# Altium project DAU-3Phase-Mainboard.PrjPcb
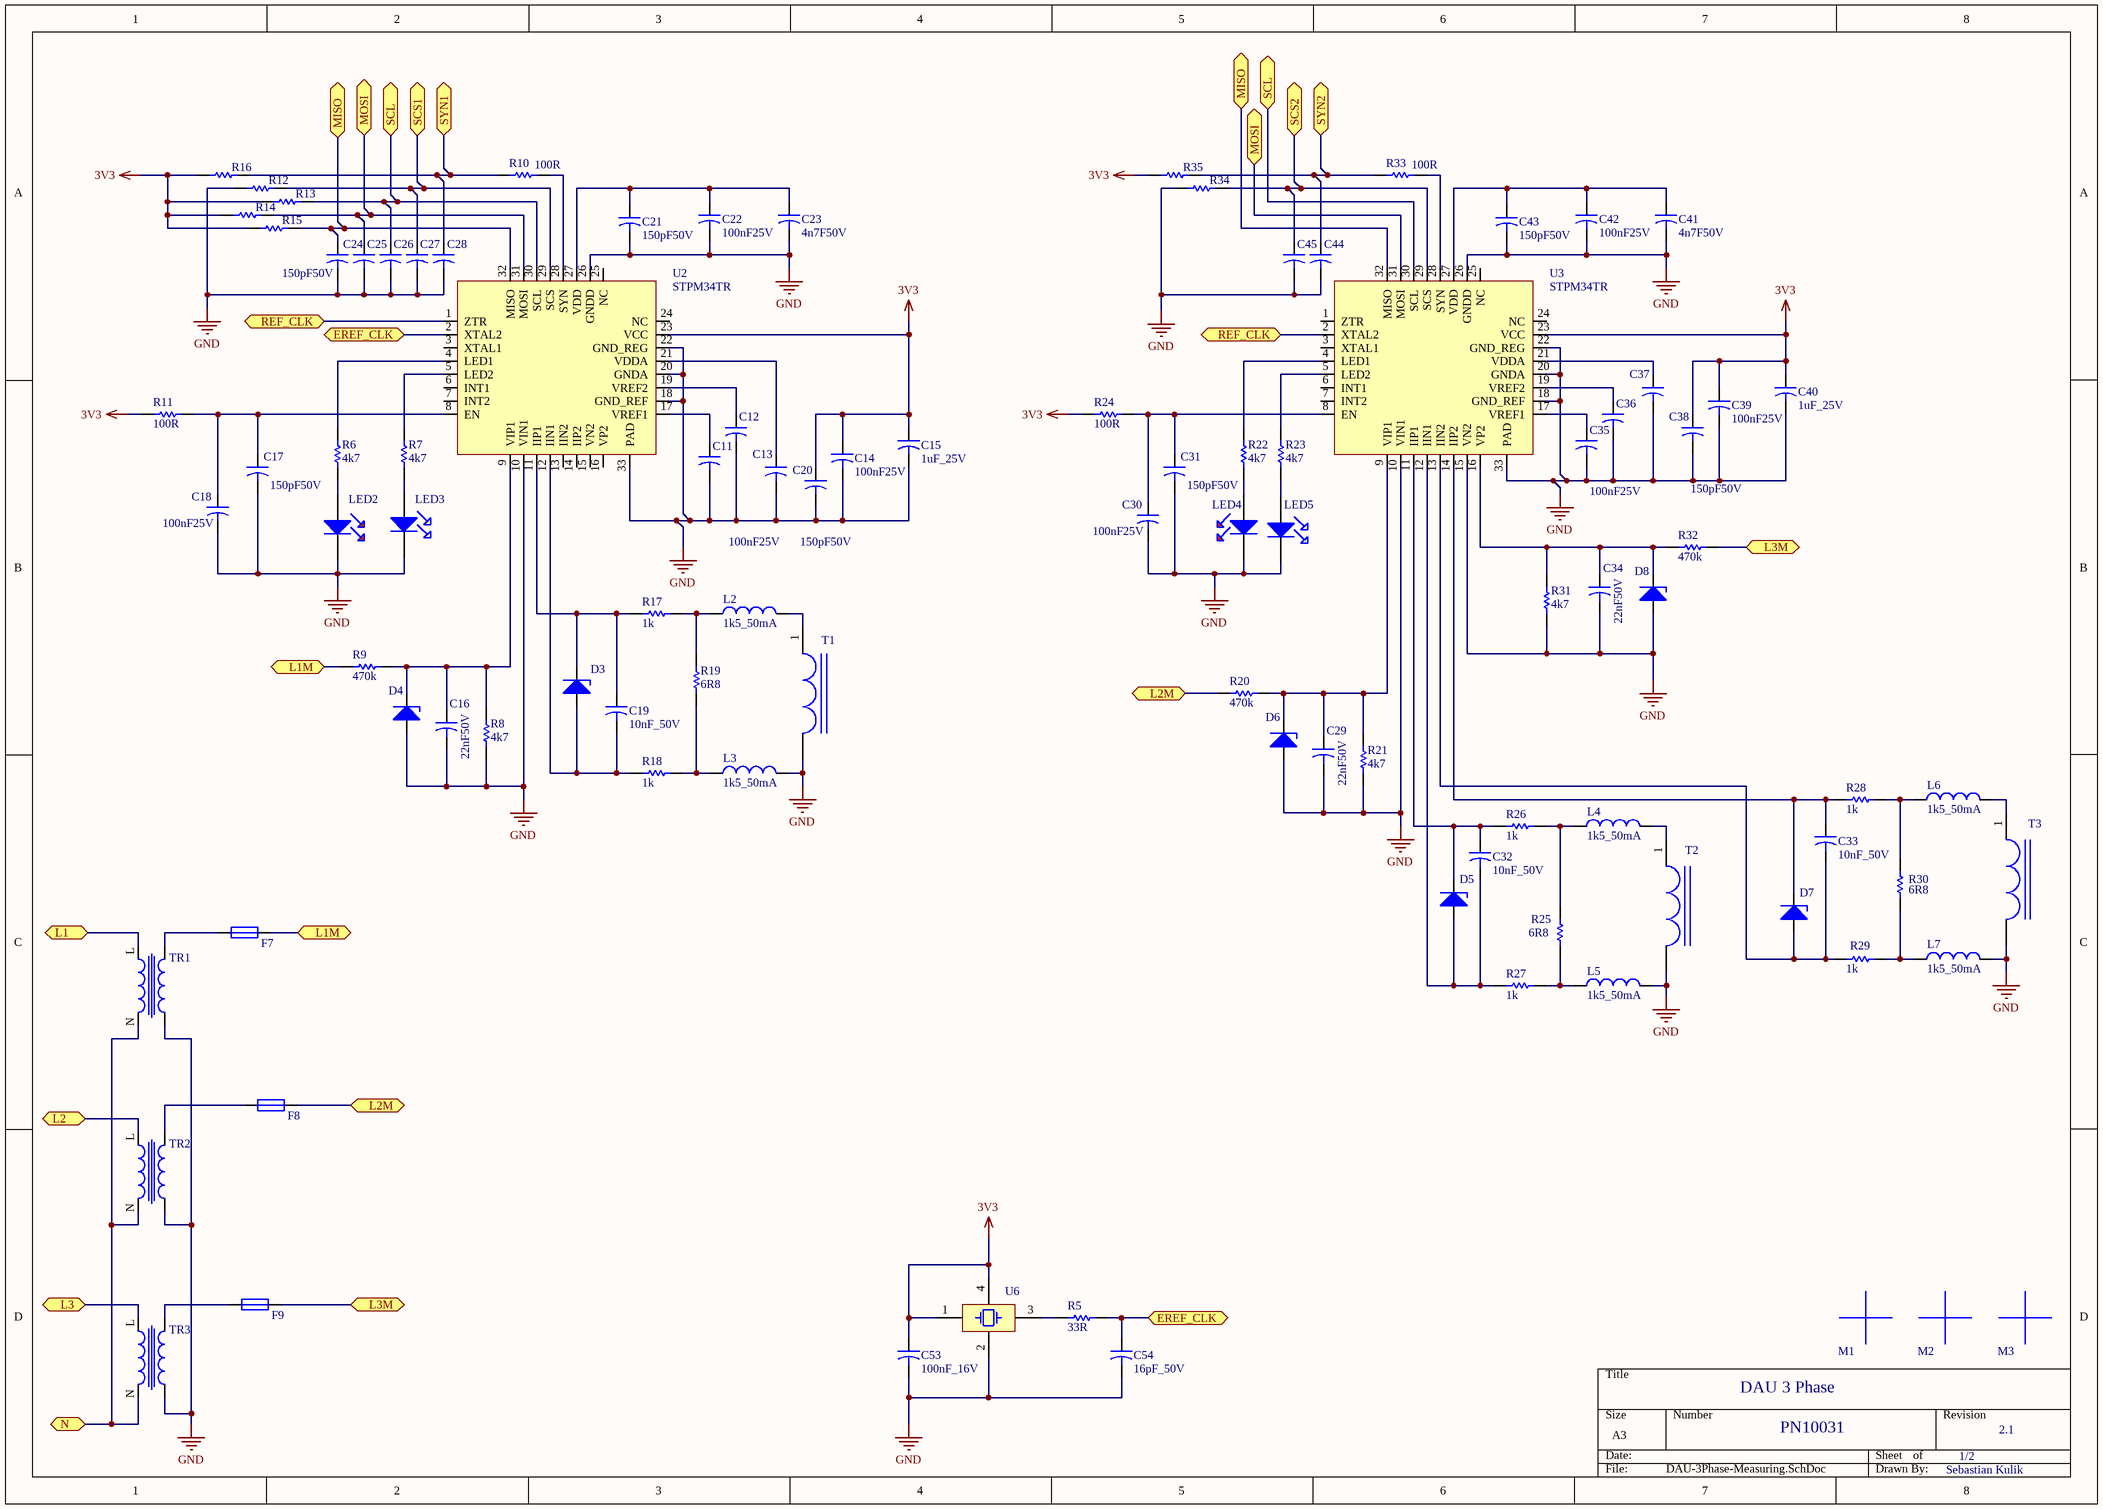
[diagram p0: DAU-3Phase-Measuring.SchDoc]
2 sheets, 149 parts. Net scope: flat (ports and power ports of the same name join across sheets).
Board file: DAU-3Phase-Mainboard.PcbDoc
Sheets:
  DAU-3Phase-Measuring.SchDoc
  DAU-3Phase-PSU.SchDoc

## Sheet DAU-3Phase-Measuring.SchDoc
size A3

### Parts
C11  value 100nF25V  [C0402]  (hidden comment: 100nF25V_0402)
C12  100nF25V_0402  [C0402]  (value not drawn)
C13  100nF25V_0402  [C0402]  (value not drawn)
C14  value 100nF25V  [C0402]  (hidden comment: 100nF25V_0402)
C15  value 1uF_25V  [C0603]  (hidden comment: 1uF25V_0603)
C16  value 22nF50V  [C0603]  (hidden comment: 22nF50V_0603)
C17  value 150pF50V  [C0402]  (hidden comment: 150p50V_0402)
C18  value 100nF25V  [C0402]  (hidden comment: 100nF25V_0402)
C19  value 10nF_50V  [C0603]  (hidden comment: 10nF50V_0603)
C20  value 150pF50V  [C0402]  (hidden comment: 150p50V_0402)
C21  value 150pF50V  [C0402]  (hidden comment: 150p50V_0402)
C22  value 100nF25V  [C0402]  (hidden comment: 100nF25V_0402)
C23  value 4n7F50V  [C0402]  (hidden comment: 4n7F50V_0402)
C24  value 150pF50V  [C0402]  (hidden comment: 150p50V_0402)
C25  150p50V_0402  [C0402]  (value not drawn)
C26  150p50V_0402  [C0402]  (value not drawn)
C27  150p50V_0402  [C0402]  (value not drawn)
C28  150p50V_0402  [C0402]  (value not drawn)
C29  value 22nF50V  [C0603]  (hidden comment: 22nF50V_0603)
C30  value 100nF25V  [C0402]  (hidden comment: 100nF25V_0402)
C31  value 150pF50V  [C0402]  (hidden comment: 150p50V_0402)
C32  value 10nF_50V  [C0603]  (hidden comment: 10nF50V_0603)
C33  value 10nF_50V  [C0603]  (hidden comment: 10nF50V_0603)
C34  value 22nF50V  [C0603]  (hidden comment: 22nF50V_0603)
C35  value 100nF25V  [C0402]  (hidden comment: 100nF25V_0402)
C36  100nF25V_0402  [C0402]  (value not drawn)
C37  100nF25V_0402  [C0402]  (value not drawn)
C38  value 150pF50V  [C0402]  (hidden comment: 150p50V_0402)
C39  value 100nF25V  [C0402]  (hidden comment: 100nF25V_0402)
C40  value 1uF_25V  [C0603]  (hidden comment: 1uF25V_0603)
C41  value 4n7F50V  [C0402]  (hidden comment: 4n7F50V_0402)
C42  value 100nF25V  [C0402]  (hidden comment: 100nF25V_0402)
C43  value 150pF50V  [C0402]  (hidden comment: 150p50V_0402)
C44  150p50V_0402  [C0402]  (value not drawn)
C45  150p50V_0402  [C0402]  (value not drawn)
C53  value 100nF_16V  [C0402]  (hidden comment: 100nF16V_0402)
C54  value 16pF_50V  [C0402]  (hidden comment: 16pF50V_0402)
D3  MMSZ4678T1G  [SOD123]  (value not drawn)
D4  MMSZ4678T1G  [SOD123]  (value not drawn)
D5  MMSZ4678T1G  [SOD123]  (value not drawn)
D6  MMSZ4678T1G  [SOD123]  (value not drawn)
D7  MMSZ4678T1G  [SOD123]  (value not drawn)
D8  MMSZ4678T1G  [SOD123]  (value not drawn)
F7  MCMET 250MA 250V  [TR5]  (value not drawn)
F8  MCMET 250MA 250V  [TR5]  (value not drawn)
F9  MCMET 250MA 250V  [TR5]  (value not drawn)
L2  value 1k5_50mA  [L0603]  (hidden comment: 1k5_50mA_0603)
L3  value 1k5_50mA  [L0603]  (hidden comment: 1k5_50mA_0603)
L4  value 1k5_50mA  [L0603]  (hidden comment: 1k5_50mA_0603)
L5  value 1k5_50mA  [L0603]  (hidden comment: 1k5_50mA_0603)
L6  value 1k5_50mA  [L0603]  (hidden comment: 1k5_50mA_0603)
L7  value 1k5_50mA  [L0603]  (hidden comment: 1k5_50mA_0603)
LED2  WL-SMCW-RED  [WE-0603]  (value not drawn)
LED3  WL-SMCW-YELLOW  [WE-0603]  (value not drawn)
LED4  WL-SMCW-RED  [WE-0603]  (value not drawn)
LED5  WL-SMCW-YELLOW  [WE-0603]  (value not drawn)
M1  Paste Mark  [Mark-3mm]  (value not drawn)
M2  Paste Mark  [Mark-3mm]  (value not drawn)
M3  Paste Mark  [Mark-3mm]  (value not drawn)
R5  value 33R  [R0402]  (hidden comment: 33R_0402)
R6  value 4k7  [R0402]  (hidden comment: 4k7_0402)
R7  value 4k7  [R0402]  (hidden comment: 4k7_0402)
R8  value 4k7  [R0204-MELF4]  (hidden comment: 4k7_0204_MELF)
R9  value 470k  [R0204-MELF4]  (hidden comment: 470k_0204_MELF)
R10  value 100R  [R0402]  (hidden comment: 100R_0402)
R11  value 100R  [R0402]  (hidden comment: 100R_0402)
R12  10k_0402  [R0402]  (value not drawn)
R13  10k_0402  [R0402]  (value not drawn)
R14  10k_0402  [R0402]  (value not drawn)
R15  10k_0402  [R0402]  (value not drawn)
R16  10k_0402  [R0402]  (value not drawn)
R17  value 1k  [R0603(1608)]  (hidden comment: 1k_0603)
R18  value 1k  [R0603(1608)]  (hidden comment: 1k_0603)
R19  value 6R8  [R0204-MELF4]  (hidden comment: 6R8_0204_MELF)
R20  value 470k  [R0204-MELF4]  (hidden comment: 470k_0204_MELF)
R21  value 4k7  [R0204-MELF4]  (hidden comment: 4k7_0204_MELF)
R22  value 4k7  [R0402]  (hidden comment: 4k7_0402)
R23  value 4k7  [R0402]  (hidden comment: 4k7_0402)
R24  value 100R  [R0402]  (hidden comment: 100R_0402)
R25  value 6R8  [R0204-MELF4]  (hidden comment: 6R8_0204_MELF)
R26  value 1k  [R0603(1608)]  (hidden comment: 1k_0603)
R27  value 1k  [R0603(1608)]  (hidden comment: 1k_0603)
R28  value 1k  [R0603(1608)]  (hidden comment: 1k_0603)
R29  value 1k  [R0603(1608)]  (hidden comment: 1k_0603)
R30  value 6R8  [R0204-MELF4]  (hidden comment: 6R8_0204_MELF)
R31  value 4k7  [R0204-MELF4]  (hidden comment: 4k7_0204_MELF)
R32  value 470k  [R0204-MELF4]  (hidden comment: 470k_0204_MELF)
R33  value 100R  [R0402]  (hidden comment: 100R_0402)
R34  10k_0402  [R0402]  (value not drawn)
R35  10k_0402  [R0402]  (value not drawn)
T1  AC1020  [AC1010]  (value not drawn)
T2  AC1020  [AC1010]  (value not drawn)
T3  AC1020  [AC1010]  (value not drawn)
TR1  BV 202 0157  [TRAFO_0,35VA]  (value not drawn)
TR2  BV 202 0157  [TRAFO_0,35VA]  (value not drawn)
TR3  BV 202 0157  [TRAFO_0,35VA]  (value not drawn)
U2  STPM34TR  [QFN32_L-Vias]
U3  STPM34TR  [QFN32_L-Vias]
U6  SG - 211 S*E -16.000M  [SG - 211 S*E]  (value not drawn)

### Ports
EREF_CLK, L1, L1M, L2, L2M, L3, L3M, MISO, MOSI, N, REF_CLK, SCL, SCS1, SCS2, SYN1, SYN2

### Nets
3V3: C14.1 C15.1 C20.1 C38.1 C39.1 C40.1 C53.1 R11.1 R13.1 R14.1 R15.1 R16.1 R24.1 R35.1 U2.23(VCC) U3.23(VCC) U6.1(E/D) U6.4(VCC)
GND: C11.2 C12.2 C13.2 C14.2 C15.2 C16.2 C17.2 C18.2 C20.2 C21.2 C22.2 C23.2 C24.2 C25.2 C26.2 C27.2 C28.2 C29.2 C30.2 C31.2 C34.2 C35.2 C36.2 C37.2 C38.2 C39.2 C40.2 C41.2 C42.2 C43.2 C44.2 C45.2 C53.2 C54.2 D4.2(A) D6.2(A) D8.2(A) L3.2 L5.2 L7.2 LED2.1(K) LED3.1(K) LED4.1(K) LED5.1(K) R8.1 R12.1 R21.1 R31.1 R34.1 T1.2 T2.2 T3.2 TR1.OUT2 TR2.OUT2 TR3.OUT2 U2.10(VIN1) U2.18(GND_REF) U2.20(GNDA) U2.22(GND_REG) U2.26(GNDD) U2.33(PAD) U3.10(VIN1) U3.15(VN2) U3.18(GND_REF) U3.20(GNDA) U3.22(GND_REG) U3.26(GNDD) U3.33(PAD) U6.2(GND)
NetC1_1: TR1.L ; port L1
NetC11_1: C11.1 U2.17(VREF1)
NetC12_1: C12.1 U2.19(VREF2)
NetC13_1: C13.1 U2.21(VDDA)
NetC16_1: C16.1 D4.1(K) R8.2 R9.2 U2.9(VIP1)
NetC17_1: C17.1 C18.1 R11.2 U2.8(EN)
NetC19_1: C19.1 D3.1(K) R17.1 U2.11(IIP1)
NetC19_2: C19.2 D3.2(A) R18.1 U2.12(IIN1)
NetC21_1: C21.1 C22.1 C23.1 U2.27(VDD)
NetC24_1: C24.1 R15.2 U2.32(MISO) U3.32(MISO) ; port MISO
NetC25_1: C25.1 R14.2 U2.31(MOSI) U3.31(MOSI) ; port MOSI
NetC26_1: C26.1 R13.2 U2.30(SCL) U3.30(SCL) ; port SCL
NetC27_1: C27.1 R12.2 U2.29(SCS) ; port SCS1
NetC28_1: C28.1 R10.2 R16.2 ; port SYN1
NetC29_1: C29.1 D6.1(K) R20.2 R21.2 U3.9(VIP1)
NetC30_1: C30.1 C31.1 R24.2 U3.8(EN)
NetC32_1: C32.1 D5.1(K) R26.1 U3.11(IIP1)
NetC32_2: C32.2 D5.2(A) R27.1 U3.12(IIN1)
NetC33_1: C33.1 D7.1(K) R28.1 U3.14(IIP2)
NetC33_2: C33.2 D7.2(A) R29.1 U3.13(IIN2)
NetC34_1: C34.1 D8.1(K) R31.2 R32.2 U3.16(VP2)
NetC35_1: C35.1 U3.17(VREF1)
NetC36_1: C36.1 U3.19(VREF2)
NetC37_1: C37.1 U3.21(VDDA)
NetC41_1: C41.1 C42.1 C43.1 U3.27(VDD)
NetC44_1: C44.1 R33.2 R35.2 ; port SYN2
NetC45_1: C45.1 R34.2 U3.29(SCS) ; port SCS2
NetC50_2: TR1.N TR2.N TR3.N ; port N
NetC54_1: C54.1 R5.2 U2.2(XTAL2) ; port EREF_CLK
NetF2_2: TR2.L ; port L2
NetF3_2: TR3.L ; port L3
NetF7_1: F7.1 TR1.OUT1
NetF7_2: F7.2 R9.1 ; port L1M
NetF8_1: F8.1 TR2.OUT1
NetF8_2: F8.2 R20.1 ; port L2M
NetF9_1: F9.1 TR3.OUT1
NetF9_2: F9.2 R32.1 ; port L3M
NetL2_1: L2.1 R17.2 R19.2
NetL2_2: L2.2 T1.1
NetL3_1: L3.1 R18.2 R19.1
NetL4_1: L4.1 R25.2 R26.2
NetL4_2: L4.2 T2.1
NetL5_1: L5.1 R25.1 R27.2
NetL6_1: L6.1 R28.2 R30.2
NetL6_2: L6.2 T3.1
NetL7_1: L7.1 R29.2 R30.1
NetLED2_2: LED2.2(A) R6.1
NetLED3_2: LED3.2(A) R7.1
NetLED4_2: LED4.2(A) R22.1
NetLED5_2: LED5.2(A) R23.1
NetR5_1: R5.1 U6.3(OSC2)
NetR6_2: R6.2 U2.4(LED1)
NetR7_2: R7.2 U2.5(LED2)
NetR10_1: R10.1 U2.28(SYN)
NetR22_2: R22.2 U3.4(LED1)
NetR23_2: R23.2 U3.5(LED2)
NetR33_1: R33.1 U3.28(SYN)
NetU2_1: U2.1(ZTR) U3.2(XTAL2) ; port REF_CLK

Not connected (* = marked no-connect by the designer): U2 3(XTAL1) 6(INT1) 7(INT2) 13(IIN2) 14(IIP2) 15(VN2) 16(VP2) 24(NC) 25(NC); U3 1(ZTR) 3(XTAL1) 6(INT1) 7(INT2) 24(NC) 25(NC)

### Notes on the sheet
- DAU 3 Phase
- PN10031
- 1/2
- 2.1
- Sebastian Kulik

### Library data of the parts
C11-C14 C18 C22 C30 C35-C37 C39 C42 = 100nF25V_0402: AVX, X5R, 10%, 25V; Deliverer PartNr: 1833862; Manufacturer PartNr: 04023D104KAT2A; Deliverer: Farnell; TDE-PN: C0036; Published: 09.12.2014; Part Description: AVX, X5R, 10%, 25V; Publisher: Sebastian Kulik; PackageDescription: C0402; Manufacturer: AVX
  C12 C13 C36 C37: Value: 100nF25V
C15 C40 = 1uF25V_0603: MLCC series, X5R, 10%, 25V; Deliverer PartNr: 1658868RL; Manufacturer: AVX; Manufacturer PartNr: 06033D105KAT2A; Deliverer: Farnell; TDE-PN: C0006; Published: 13.02.2014; Part Description: MLCC series, X5R, 10%, 25V; Publisher: Sebastian Kulik; PackageDescription: C0603
C16 C29 C34 = 22nF50V_0603: AVX ,  X7R, 5%, 50V; Deliverer PartNr: 1835412; Manufacturer PartNr: 06035C223JAT2A; Deliverer: Farnell; TDE-PN: C0034; Published: 13.02.2014; Part Description: AVX ,  X7R, 5%, 50V; Publisher: Sebastian Kulik; PackageDescription: C0603; Manufacturer: AVX
C17 C20 C21 C24 C31 C38 C43 = 150p50V_0402: C series, 5%, 50V; Part Description: GRM series,5%, 50V; Deliverer PartNr: 8819602; Manufacturer: Murata; Manufacturer PartNr: GRM1555C1H151JA01D; Deliverer: Farnell; TDE-PN: C0059; Published: 11.12.2014; Publisher: Sebastian Kulik; PackageDescription: C0402
C19 C32 C33 = 10nF50V_0603: GRM series,  X7R, 10%, 50V; Deliverer PartNr: 2366904; Manufacturer: Murata; Manufacturer PartNr: GRM188R71H103KA01D; Deliverer: Farnell; TDE-PN: C0060; Published: 12.12.2014; Part Description: GRM series,  X7R, 10%, 50V; Publisher: Sebastian Kulik; PackageDescription: C0603
C23 C41 = 4n7F50V_0402: AVX, X7R, 10%, 50V; Deliverer PartNr: 2280797; Manufacturer PartNr: 04025C472KAT2A; Deliverer: Farnell; TDE-PN: C0001; Published: 11.02.2014; Part Description: AVX, X7R, 10%, 50V; Publisher: Sebastian Kulik; PackageDescription: C0402; Manufacturer: AVX
C25-C28 C44 C45 = 150p50V_0402: C series, 5%, 50V; Part Description: GRM series,5%, 50V; Deliverer PartNr: 8819602; Manufacturer: Murata; Manufacturer PartNr: GRM1555C1H151JA01D; Deliverer: Farnell; TDE-PN: C0059; Value: 150pF50V; Published: 11.12.2014; Publisher: Sebastian Kulik; PackageDescription: C0402
C53 = 100nF16V_0402: TDK. CGA series, X7R, 10%, 16V; Deliverer PartNr: 2366533; Manufacturer: TDK; Manufacturer PartNr: CGA2B1X7R1C104K050BC; Deliverer: Farnell; TDE-PN: C0025; Published: 12.02.2014; Part Description: TDK. CGA series, X7R, 10%, 16V; Publisher: Sebastian Kulik; PackageDescription: C0402
C54 = 16pF50V_0402: C series, 5%, 50V; Deliverer PartNr: 1865423; Manufacturer: Kemet; Manufacturer PartNr: C0402C160J5GACTU; Deliverer: Farnell; TDE-PN: C0020; Published: 11.03.2014; Part Description: C series, 5%, 50V; Publisher: Sebastian Kulik; PackageDescription: C0402
D3-D8 = MMSZ4678T1G: Z-Diode, 1.8V,  0.5W; Deliverer PartNr: 1459115; Manufacturer: ON Semi; TDE-PN: DIS0034; Deliverer: Farnell; Published: 29.04.2014; Publisher: Sebastian Kulik; PackageDescription: SOD-123; Manufacturer PartNr: MMSZ4678T1G
F7-F9 = MCMET 250MA 250V: Deliverer PartNr: 1566065; Manufacturer: Multicomp; Deliverer: Farnell; TDFE-PN: M0008; Published: 05.11.2014; Publisher: Sebastian Kulik; PackageDescription: TR-5; Manufacturer PartNr: MCMET 250MA 250V; Value: MCMET 250MA 250V
L2-L7 = 1k5_50mA_0603: WE, Ferrit, 1k5_50mA_0603; Deliverer PartNr: 742792691; TDE-PN: P0028; Deliverer: WE; Manufacturer: WE; Manufacturer PartNr: 742792691; Published: 11.12.2014; Publisher: Sebastian Kulik; PackageDescription: L0603
LED2 LED4 = WL-SMCW-RED: LED, 0603, red; Manufacturer PartNr: 150060RS75000; TDE-PN: DIS0023; Deliverer: WE; Published: 24.05.2014; Publisher: Sebastian Kulik; PackageDescription: WE-0603; Deliverer PartNr: 150060RS75000; Manufacturer: WE
LED3 LED5 = WL-SMCW-YELLOW: LED, 0603, yellow; Manufacturer PartNr: 150060YS75000; TDE-PN: DIS0025; Deliverer: WE; Published: 24.05.2014; Publisher: Sebastian Kulik; PackageDescription: WE-0603; Deliverer PartNr: 150060YS75000; Manufacturer: WE
M1-M3 = Mark: Comment_1: PasteMark
R5 = 33R_0402: Vishay CRCW series, 63mW, 1%; Manufacturer PartNr: CRCW040233R0FKEAHP; Deliverer PartNr: 1738830; TDE-PN: R0037; Deliverer: Farnell; Published: 12.02.2014; Publisher: Sebastian Kulik; PackageDescription: 0402; Manufacturer: Vishay; Part Description: Vishay CRCW series, 63mW, 1%
R6 R7 R22 R23 = 4k7_0402: Vishay CRCW series, 63mW, 1%; Manufacturer PartNr: CRCW04024K70FKED; Deliverer PartNr: 2121688; TDE-PN: R0009; Deliverer: Farnell; Published: 25.02.2014; Publisher: Sebastian Kulik; PackageDescription: 0402; Manufacturer: Vishay; Part Description: Vishay CRCW series, 63mW, 1%
R8 R21 R31 = 4k7_0204_MELF: MMA series, 1%, 250mW; Manufacturer: Vishay; Manufacturer PartNr: MMA02040E4701BB100; Deliverer PartNr: 3086100; TDE-PN: R0073; Deliverer: Farnell; Published: 23.02.2015; Publisher: Sebastian Kulik; PackageDescription: R0204-MELF4; Part Description: MMA series, 1%, 250mW
R9 R20 R32 = 470k_0204_MELF: MMA series, 1%, 250mW; Manufacturer: Vishay; Manufacturer PartNr: MMA02040C4703FB300; Deliverer PartNr: 3088108; TDE-PN: R0074; Deliverer: Farnell; Published: 23.02.2015; Publisher: Sebastian Kulik; PackageDescription: R0204-MELF4; Part Description: MMA series, 1%, 250mW
R10 R11 R24 R33 = 100R_0402: CRCW series, 125mW, 1%; Manufacturer: Vishay; Manufacturer PartNr: CRCW0402100RFKEAHP; Deliverer PartNr: 1738837RL; TDE-PN: R0026; Deliverer: Farnell; Published: 07.04.2014; Publisher: Sebastian Kulik; PackageDescription: 0402; Part Description: CRCW series, 125mW, 1%
R12-R16 R34 R35 = 10k_0402: Vishay CRCW series, 125mW, 1%; Manufacturer PartNr: CRCW040210K0FKEAHP; Deliverer PartNr: 1738864; TDE-PN: R0012; Deliverer: Farnell; Value: 10k; Published: 12.02.2014; Publisher: Sebastian Kulik; PackageDescription: 0402; Manufacturer: Vishay; Part Description: Vishay CRCW series, 125mW, 1%
R17 R18 R26-R29 = 1k_0603: Vishay CRCW series, 100mW, 1%; Manufacturer PartNr: CRCW06031K00FKTA; Deliverer PartNr: 1652848; TDE-PN: R0070; Deliverer: Farnell; Published: 03.04.2014; Publisher: Sebastian Kulik; PackageDescription: 0603; Manufacturer: Vishay; Part Description: Vishay CRCW series, 100mW, 1%
R19 R25 R30 = 6R8_0204_MELF: MMA series, 1%, 250mW; Manufacturer: Vishay; Manufacturer PartNr: MMA02040C6808FB300; Deliverer PartNr: 3087529; TDE-PN: R0071; Deliverer: Farnell; Published: 12.12.2014; Publisher: Sebastian Kulik; PackageDescription: R0204-MELF4; Part Description: MMA series, 1%, 250mW
T1-T3 = AC1020: Current transformer; Manufacturer PartNr: AC-1020; Deliverer PartNr: 1707839; Manufacturer: Acme Electric; TDE-PN: DIS0028; Deliverer: Farnell; Published: 28.10.2014; Publisher: Sebastian Kulik; PackageDescription: AC1010
TR1-TR3 = BV 202 0157: WE-PD2, 10uH2A; Deliverer PartNr: 1636035; Manufacturer: Hahn; Deliverer: Farnell; TDE-PN: P0024; Manufacturer PartNr: BV 202 0157; Published: 05.11.2014; Publisher: Sebastian Kulik; PackageDescription: TRAFO_0,35VA; Value: BV 202 0157
U2 U3 = STPM34TR: 2 phase voltage/current measuring device; Manufacturer: STMicro; Deliverer: EBV; TDE-PN: IC0064; Published: 10.12.2014; Deliverer PartNr: STPM34TR; PackageDescription: QFN32L; Publisher: Sebastian Kulik; Manufacturer PartNr: STPM34TR
U6 = SG - 211 S*E -16.000M: Crystal; Deliverer PartNr: 2405755; Manufacturer PartNr: X1G0036210032; Manufacturer: Epson; Deliverer: Farnell; TDE-PN: IC0061; Published: 11.12.2014; PackageDescription: SG-221 S*E; Publisher: Sebastian Kulik

## Sheet DAU-3Phase-PSU.SchDoc
size A3
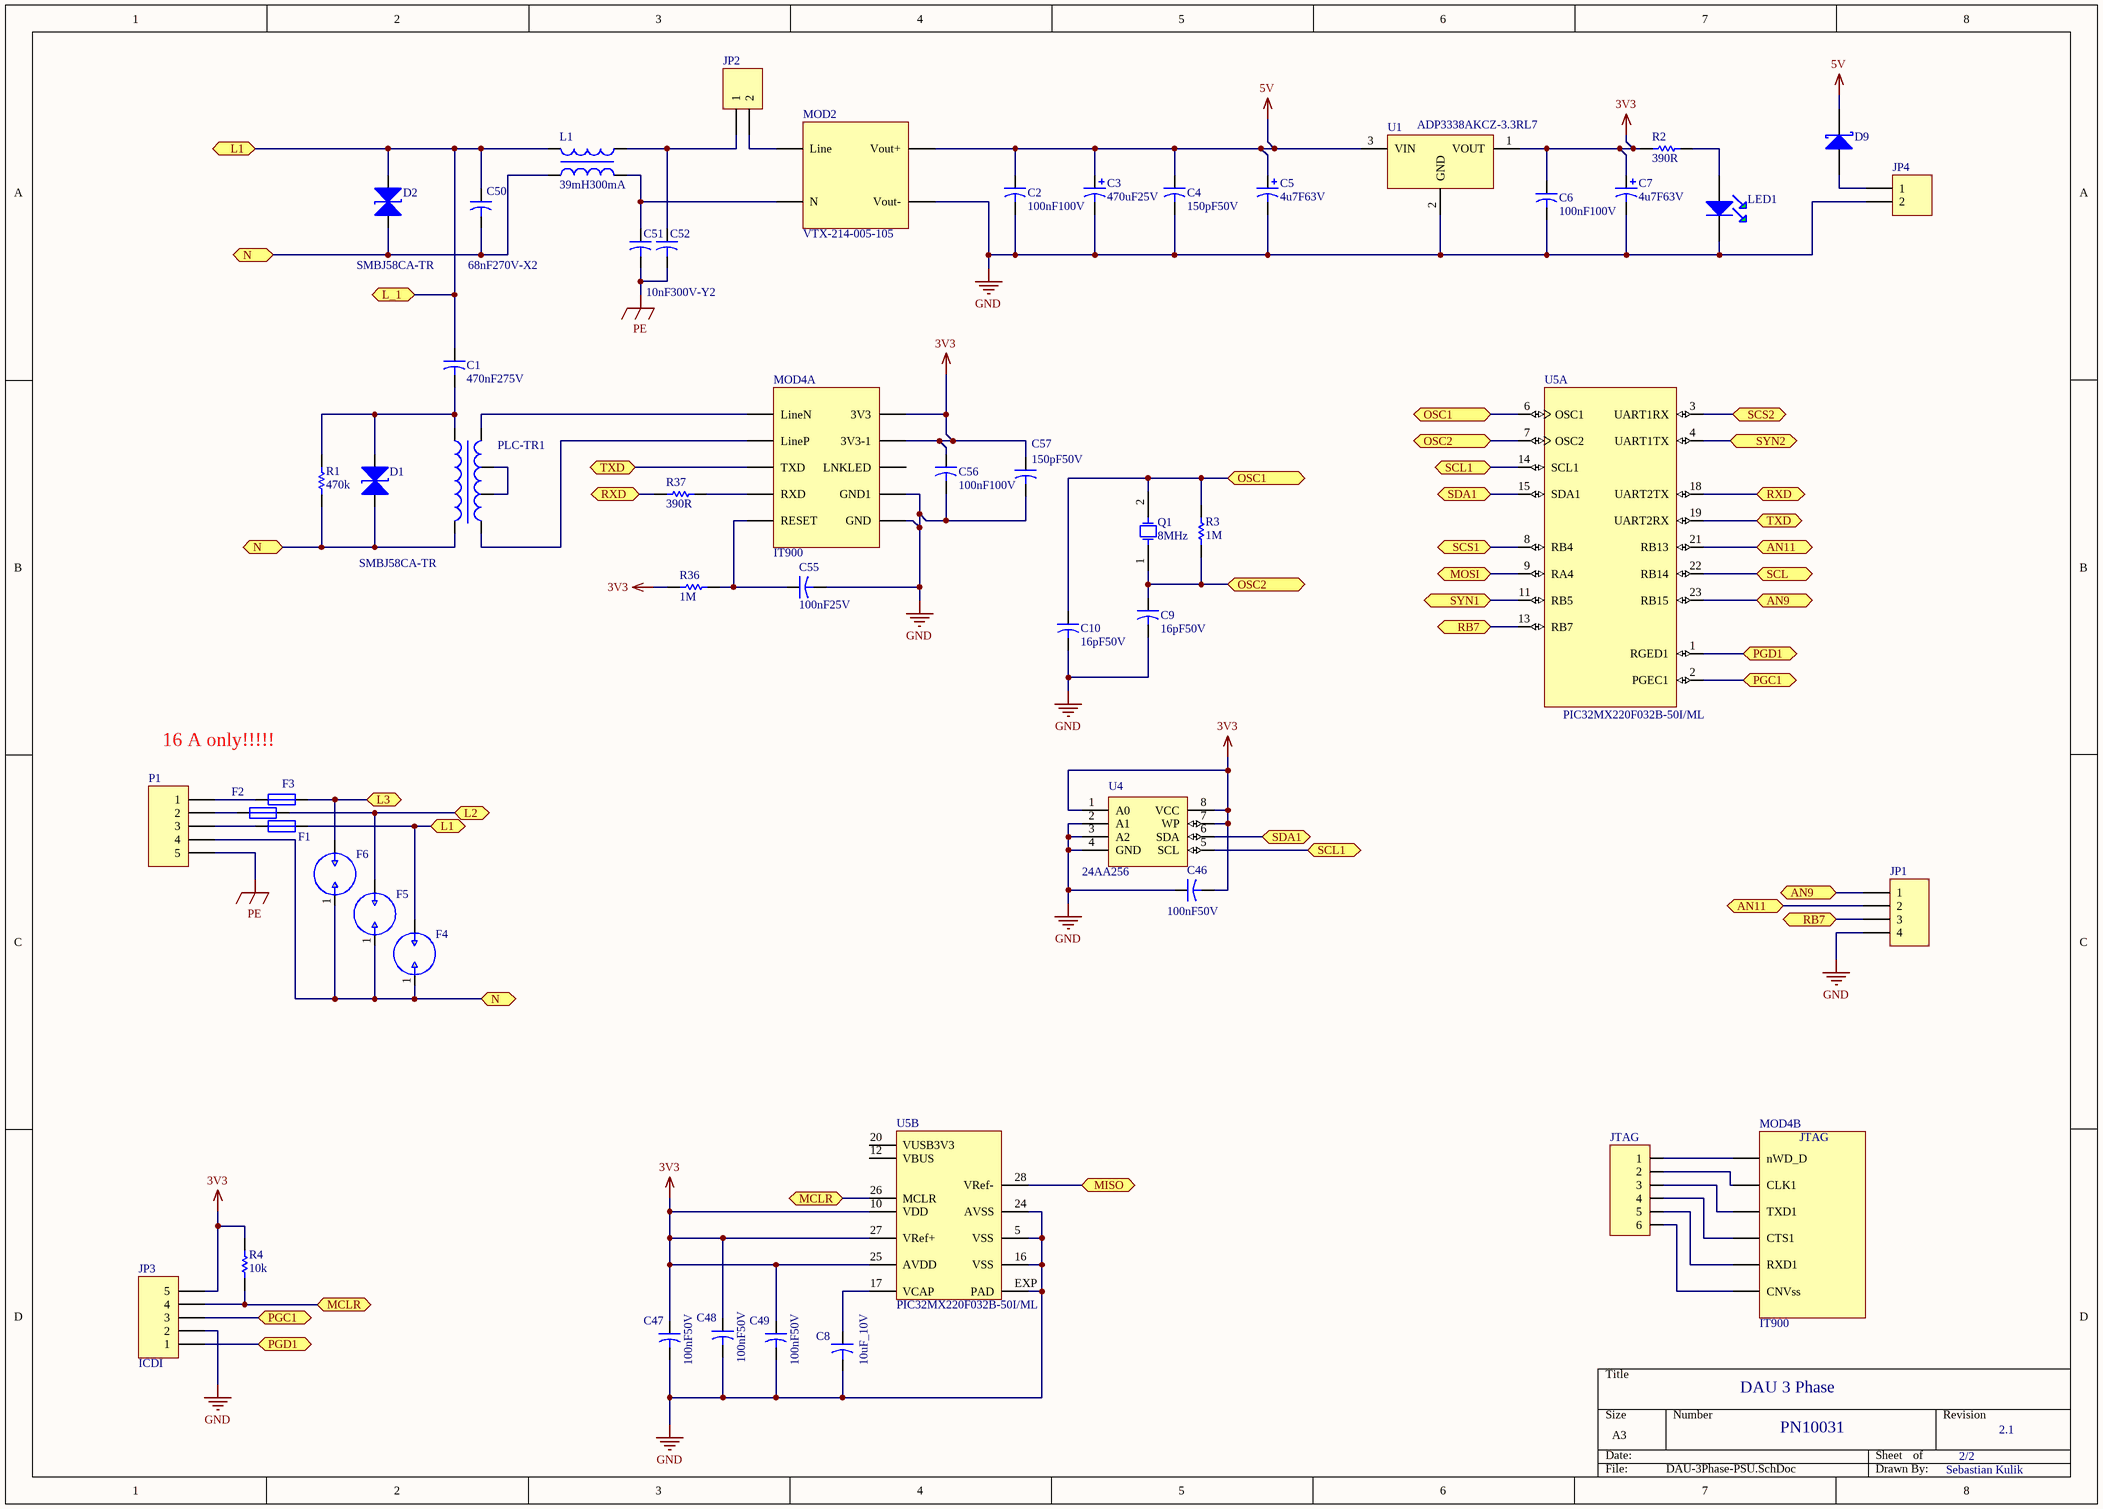
[diagram p1: DAU-3Phase-PSU.SchDoc]

### Parts
C1  470nF275V  [C150-072X183]
C2  value 100nF100V  [C0805]  (hidden comment: 100nF100V_0805)
C3  value 470uF25V  [Panasonic-FT-F_Case]  (hidden comment: 470uF25V_POL_FT)
C4  value 150pF50V  [C0402]  (hidden comment: 150p50V_0402)
C5  value 4u7F63V  [Panasonic-FT-C_Case]  (hidden comment: 4u7F25V_POL_TK)
C6  value 100nF100V  [C0805]  (hidden comment: 100nF100V_0805)
C7  value 4u7F63V  [Panasonic-FT-C_Case]  (hidden comment: 4u7F25V_POL_TK)
C8  value 10uF_10V  [C0603]  (hidden comment: 10uF10V_0603)
C9  value 16pF50V  [C0402]  (hidden comment: 16pF50V_0402)
C10  value 16pF50V  [C0402]  (hidden comment: 16pF50V_0402)
C46  value 100nF50V  [C0402]  (hidden comment: 100n50V_0402)
C47  value 100nF50V  [C0402]  (hidden comment: 100n50V_0402)
C48  value 100nF50V  [C0402]  (hidden comment: 100n50V_0402)
C49  value 100nF50V  [C0402]  (hidden comment: 100n50V_0402)
C50  68nF270V-X2  [Foil-7,5x10]
C51  10nF300V-Y2  [Foil-10x13]  (value not drawn)
C52  10nF300V-Y2  [Foil-10x13]
C55  value 100nF25V  [C0402]  (hidden comment: 100nF25V_0402)
C56  value 100nF100V  [C0805]  (hidden comment: 100nF100V_0805)
C57  value 150pF50V  [C0402]  (hidden comment: 150p50V_0402)
D1  SMBJ58CA-TR  [SMB]
D2  SMBJ58CA-TR  [SMB]
D9  RB160M-30TR  [SOD123]  (value not drawn)
F1  MCMET 250MA 250V  [TR5]  (value not drawn)
F2  MCMET 250MA 250V  [TR5]  (value not drawn)
F3  MCMET 250MA 250V  [TR5]  (value not drawn)
F4  GDT-SL1011A-1  [SL1011A/SL1011B]  (value not drawn)
F5  GDT-SL1011A-1  [SL1011A/SL1011B]  (value not drawn)
F6  GDT-SL1011A-1  [SL1011A/SL1011B]  (value not drawn)
JP1  Plug_4_90_2.54  [HDR1X4]  (value not drawn)
JP2  Header-2  [HDR1X2]  (value not drawn)
JP3  ICDI  [HDR1X5-1.27]
JP4  Header-2  [HDR1X2]  (value not drawn)
JTAG  JTAG  [HDR1X6-1.27]  (value not drawn)
L1  value 39mH300mA  [WE-CMB-XS]  (hidden comment: PowerChoke-2)
LED1  WL-SMCW-GREEN  [WE-0603]  (value not drawn)
MOD2  VTX-214-005-105  [VTX-214-005-105]
MOD4  IT900  [IT900-PIM]  (parts A,B of 2)
P1  Plug_05_5mm  [CONNECTOR_5_POL-5mm]  (value not drawn)
PLC-TR1  PLC-Transformer  [PLC-UEBERTRAGER_V2]  (value not drawn)
Q1  value 8MHz  [ABM3]  (hidden comment: Crystal_8MHz_1)
R1  value 470k  [0204/7]  (hidden comment: 470k_0204/7)
R2  value 390R  [R0402]  (hidden comment: 390R_0402)
R3  value 1M  [R0402]  (hidden comment: 1M_0402)
R4  value 10k  [R0402]  (hidden comment: 10k_0402)
R36  value 1M  [R0402]  (hidden comment: 1M_0402)
R37  value 390R  [R0402]  (hidden comment: 390R_0402)
U1  ADP3338AKCZ-3.3RL7  [SOT223-1]
U4  24AA256  [TSSOP8]
U5  PIC32MX220F032B-50I/ML  [QFN28_LONG_ERRLES-Vias]  (parts A,B of 2)

### Ports
AN9, AN11, L1, L2, L3, L_1, MCLR, MISO, MOSI, N, OSC1, OSC2, PGC1, PGD1, RB7, RXD, SCL, SCL1, SCS1, SCS2, SDA1, SYN1, SYN2, TXD

### Nets
3V3: C6.1 C7.1 C46.2 C47.1 C48.1 C49.1 C56.1 C57.1 JP3.5 MOD4.4(3V3) MOD4.5(3V3-1) R2.1 R4.2 R36.1 U1.1(VOUT) U4.1(A0) U4.7(WP) U4.8(VCC) U5.10(VDD) U5.25(AVDD) U5.27(VRef+)
5V: C2.1 C3.1 C4.1 C5.1 D9.1(K) MOD2.+VO(Vout+) U1.3(VIN)
GND: C2.2 C3.2 C4.2 C5.2 C6.2 C7.2 C8.2 C9.2 C10.2 C46.1 C47.2 C48.2 C49.2 C55.2 C56.2 C57.2 JP1.4 JP3.2 JP4.2 LED1.1(K) MOD2.-VO(Vout-) MOD4.2(GND) MOD4.3(GND1) U1.2(GND) U4.2(A1) U4.3(A2) U4.4(GND) U5.5(VSS) U5.16(VSS) U5.24(AVSS) U5.EXP(PAD)
PE: C51.2 C52.2 P1.5
NetC1_1: C1.1 C50.1 D2.2(A) F1.2 F4.2 L1.2 ; port L_1, port L1
NetC1_2: C1.2 D1.2(A) PLC-TR1.L5 R1.2
NetC8_1: C8.1 U5.17(VCAP)
NetC9_1: C9.1 Q1.1 R3.1 U5.7(OSC2) ; port OSC2
NetC10_1: C10.1 Q1.2 R3.2 U5.6(OSC1) ; port OSC1
NetC24_1: U5.28(VRef-) ; port MISO
NetC25_1: U5.9(RA4) ; port MOSI
NetC26_1: U5.22(RB14) ; port SCL
NetC27_1: U5.8(RB4) ; port SCS1
NetC28_1: U5.11(RB5) ; port SYN1
NetC44_1: U5.4(UART1TX) ; port SYN2
NetC45_1: U5.3(UART1RX) ; port SCS2
NetC50_2: C50.2 D1.1(K) D2.1(K) F4.1 F5.1 F6.1 L1.1 P1.4 PLC-TR1.8N R1.1 ; port N
NetC51_1: C51.1 L1.4 MOD2.N
NetC52_1: C52.1 JP2.1 L1.3
NetC55_1: C55.1 MOD4.9(RESET) R36.2
NetD9_2: D9.2(A) JP4.1
NetF1_1: F1.1 P1.3
NetF2_1: F2.1 P1.2
NetF2_2: F2.2 F5.2 ; port L2
NetF3_1: F3.1 P1.1
NetF3_2: F3.2 F6.2 ; port L3
NetJP1_1: JP1.1 U5.23(RB15) ; port AN9
NetJP1_2: JP1.2 U5.21(RB13) ; port AN11
NetJP1_3: JP1.3 U5.13(RB7) ; port RB7
NetJP2_2: JP2.2 MOD2.L(Line)
NetJP3_1: JP3.1 U5.1(RGED1) ; port PGD1
NetJP3_3: JP3.3 U5.2(PGEC1) ; port PGC1
NetJP3_4: JP3.4 R4.1 U5.26(MCLR) ; port MCLR
NetJTAG_1: JTAG.1 MOD4.26(nWD_D)
NetJTAG_2: JTAG.2 MOD4.27(CLK1)
NetJTAG_3: JTAG.3 MOD4.28(TXD1)
NetJTAG_4: JTAG.4 MOD4.29(CTS1)
NetJTAG_5: JTAG.5 MOD4.30(RXD1)
NetJTAG_6: JTAG.6 MOD4.31(CNVss)
NetLED1_2: LED1.2(A) R2.2
NetMOD4_16: MOD4.16(TXD) U5.19(UART2RX) ; port TXD
NetMOD4_17: MOD4.17(RXD) R37.2
NetMOD4_20: MOD4.20(LineN) PLC-TR1.1LINE1(LINE1)
NetMOD4_21: MOD4.21(LineP) PLC-TR1.4LINE2
NetPLC-TR1_2: PLC-TR1.2 PLC-TR1.3
NetR37_1: R37.1 U5.18(UART2TX) ; port RXD
NetU4_5: U4.5(SCL) U5.14(SCL1) ; port SCL1
NetU4_6: U4.6(SDA) U5.15(SDA1) ; port SDA1

Not connected (* = marked no-connect by the designer): MOD4 22(LNKLED); U5 12(VBUS) 20(VUSB3V3)

### Notes on the sheet
- 16 A only!!!!!
- DAU 3 Phase
- PN10031
- 2/2
- 2.1
- Sebastian Kulik
- (in symbol IT900, part B) JTAG

### Library data of the parts
C1 = 470nF275V: X2, PP; Deliverer PartNr: 2450023; Manufacturer: WE; Manufacturer PartNr: 890324025039CS; Deliverer: Farnell; TDE-PN: C0053; Published: 07.11.2014; Part Description: X2, PP; Publisher: Sebastian Kulik; PackageDescription: C150-072X183; Value: 470nF275V
C2 C6 C56 = 100nF100V_0805: AVX, X7R, 5%, 100V; Deliverer PartNr: 2332715; Manufacturer PartNr: 08051C104JAT2A; Deliverer: Farnell; TDE-PN: C0049; Published: 27.10.2014; Part Description: AVX, X7R, 5%, 100V; Publisher: Sebastian Kulik; PackageDescription: C0805; Manufacturer: AVX
C3 = 470uF25V_POL_FT: Panasonic, FT series; Deliverer PartNr: 1868411; Manufacturer PartNr: EEEFT1E471AP; Deliverer: Farnell; TDE-PN: C0048; Published: 23.09.2014; Part Description: Panasonic, FT series; Publisher: Sebastian Kulik; PackageDescription: Panasonic-FT-F; Manufacturer: Panasonic
C4 C57 = 150p50V_0402: as C17 on sheet DAU-3Phase-Measuring; Published: 11.12.2014; Publisher: Sebastian Kulik; PackageDescription: C0402
C5 C7 = 4u7F25V_POL_TK: Panasonic, TK series; Deliverer PartNr: 9695990; Manufacturer PartNr: EEEFK1J4R7R; Deliverer: Farnell; TDE-PN: C0058; Published: 11.12.2014; Part Description: Panasonic, TK series; Publisher: Sebastian Kulik; PackageDescription: Panasonic-FT-C_Case; Manufacturer: Panasonic
C8 = 10uF10V_0603: AVX ,  X5R, 20%, 10V; Deliverer PartNr: 1867954RL; Manufacturer PartNr: 0603ZD106MAT2A; Deliverer: Farnell; TDE-PN: C0016; Published: 11.02.2014; Part Description: AVX ,  X5R, 20%, 10V; Publisher: Sebastian Kulik; PackageDescription: C0603; Manufacturer: AVX
C9 C10 = 16pF50V_0402: as C54 on sheet DAU-3Phase-Measuring; Published: 11.03.2014; Part Description: C series, 5%, 50V; Publisher: Sebastian Kulik; PackageDescription: C0402
C46-C49 = 100n50V_0402: C series, X5R, 10%, 50V; Part Description: GRM series, X5R, 10%, 50V; Deliverer PartNr: 2218856; Manufacturer: Murata; Manufacturer PartNr: GRM155R61H104KE19D; Deliverer: Farnell; TDE-PN: C0044; Published: 13.02.2014; Publisher: Sebastian Kulik; PackageDescription: C0402
C50 = 68nF270V-X2: X2 capacitor; Deliverer PartNr: 890324022017CS; Deliverer: We; TDE-PN: C0061; Published: 21.01.2015; Part Description: X2 capacitor; Publisher: Sebastian Kulik; PackageDescription: Foil-7,5x10; Manufacturer: WE; Manufacturer PartNr: 890324022017CS; Value: 68nF270V-X2
C51 C52 = 10nF300V-Y2: Y2 capacitor; Deliverer PartNr: 2395807; Manufacturer: EPCOS; Manufacturer PartNr: B32021A3103M; Deliverer: Farnell; TDE-PN: C0062; Published: 22.01.2015; Part Description: Y2 capacitor; Publisher: Sebastian Kulik; PackageDescription: Foil-10x13; Value: 10nF300V-Y2
C55 = 100nF25V_0402: as C11 on sheet DAU-3Phase-Measuring; Published: 09.12.2014; Part Description: AVX, X5R, 10%, 25V; Publisher: Sebastian Kulik; PackageDescription: C0402; Manufacturer: AVX
D1 D2 = SMBJ58CA-TR: Transient voltage suppressor, 600W; Deliverer PartNr: 9886346; Manufacturer: STMicro; TDE-PN: DIS0036; Deliverer: Farnell; Published: 22.01.2015; Publisher: Sebastian Kulik; PackageDescription: SMB; Manufacturer PartNr: SMBJ58CA-TR
D9 = RB160M-30TR: Diode Schottky,2A,40V; Deliverer PartNr: 1525480; Manufacturer: Rohm; TDE-PN: DIS0010; Deliverer: Farnell; Published: 17.02.2014; Publisher: Sebastian Kulik; PackageDescription: SOD123; Manufacturer PartNr: RB160M-30TR
F1-F3 = MCMET 250MA 250V: as F7 on sheet DAU-3Phase-Measuring; Published: 05.11.2014; Publisher: Sebastian Kulik; PackageDescription: TR-5; Manufacturer PartNr: MCMET 250MA 250V; Value: MCMET 250MA 250V
F4-F6 = GDT-SL1011A-1: surge protector; Manufacturer PartNr: SL1011B250A; Deliverer PartNr: 1815462; Manufacturer: LITTLEFUSE; TDE-PN: P0031; Deliverer: Farnell; Published: 12.12.2014; Publisher: Sebastian Kulik; PackageDescription: SL1011A/SL1011B
JP1 = Plug_4_90_2.54: Plug, 4-Pin; Manufacturer PartNr: 613 004 111 21; Manufacturer: WE; TDE-PN: CON0033; LatestRevisionDate: 06.11.2014; LatestRevisionNote: Re-released for DXP Platform.; Publisher: Sebastian Kulik; Deliverer: WE; Deliverer PartNr: 613 004 111 21
JP2 JP4 = Header-2: Header, 2-Pin; LatestRevisionDate: 18.02.2014; LatestRevisionNote: Re-released for DXP Platform.; Publisher: Sebastian Kulik
JP3 = ICDI: Header, 5-Pin; LatestRevisionDate: 17-Jul-2002; LatestRevisionNote: Re-released for DXP Platform.; Publisher: Sebastian Kulik; PackageDescription: HDR1X1.27
JTAG = ICDI_1: Header, 6-Pin; LatestRevisionDate: 17-Jul-2002; LatestRevisionNote: Re-released for DXP Platform.; Publisher: Sebastian Kulik; PackageDescription: HDR1X1.27
L1 = PowerChoke-1_2: Power choke/EMC filter; Deliverer PartNr: 744821039; Deliverer: WE; TDE-PN: P0033; Manufacturer: WE; Manufacturer PartNr: 744821039; Published: 21.01.2015; Publisher: Sebastian Kulik; PackageDescription: WE-CMB-XS
LED1 = WL-SMCW-GREEN: LED, 0603, green; Manufacturer PartNr: 150060GS75000; TDE-PN: DIS0024; Deliverer: WE; Published: 24.05.2014; Publisher: Sebastian Kulik; PackageDescription: WE-0603; Deliverer PartNr: 150060GS75000; Manufacturer: WE
MOD2 = VTX-214-005-105: PSU module; Deliverer PartNr: 2401040; Manufacturer: VIGORTRONIX; Deliverer: Farnell; TDE-PN: MOD00005; Published: 15.12.2014; PackageDescription: VTX-214-005-105; Publisher: Sebastian Kulik; Manufacturer PartNr: VTX-214-005-105
MOD4 = IT900: RMS converter; Deliverer PartNr: MOD00001; Deliverer: TDE; TDE-PN: MOD00004; Published: 15.12.2014; PackageDescription: TO100-10; Publisher: Sebastian Kulik; Manufacturer PartNr: MOD00001; Manufacturer: TDE
P1 = Plug_05_5mm: Plug, 08-Pin; Manufacturer PartNr: 1715187; Manufacturer: Phoenix Contact; Deliverer PartNr: 2509901353; Deliverer: RS Components; TDE-PN: CON0037; LatestRevisionDate: 19.11.2014; LatestRevisionNote: Re-released for DXP Platform.; Publisher: Sebastian Kulik
PLC-TR1 = PLC-Transformer: Deliverer PartNr: T60403-K5024-X044; Manufacturer: VAC; Deliverer: SOS Electronic; TDE-PN: P0025; Manufacturer PartNr: T60403-K5024-X044; Published: 13.05.2014; Publisher: Sebastian Kulik; PackageDescription: PLC-UEBERTRAGER_V2
Q1 = Crystal_8MHz_1: Crystal, ABM3-8.000MHZ-D2Y-T; Deliverer PartNr: 2101329; Manufacturer: Abacon; Deliverer: Farnell; TDE-PN: P0032; Published: 20.01.2015; PackageDescription: ABM3; Publisher: Sebastian Kulik; Manufacturer PartNr: ABM3-8.000MHZ-D2Y-T
R1 = 470k_0204/7: MRS25 series, 1%, 600mW; Manufacturer: Vishay; Manufacturer PartNr: MRS25000C4703FCT00; Deliverer PartNr: 9468455; TDE-PN: R0061; Deliverer: Farnell; Published: 07.11.2014; Publisher: Sebastian Kulik; PackageDescription: 0204/7; Part Description: MRS25 series, 1%, 600mW
R2 R37 = 390R_0402: CRCW series, 125mW, 1%; Manufacturer: Vishay; Manufacturer PartNr: CRCW0402390RFKEAHP; Deliverer PartNr: 1469662RL; TDE-PN: R0044; Deliverer: Farnell; Published: 30.04.2014; Publisher: Sebastian Kulik; PackageDescription: 0402; Part Description: CRCW series, 125mW, 1%
R3 R36 = 1M_0402: Vishay CRCW series, 64mW, 1%; Manufacturer PartNr: CRCW04021M00FKED; Deliverer PartNr: 1469667; Part Description: Vishay CRCW series, 63mW, 1%; TDE-PN: R0005; Deliverer: Farnell; Published: 03.04.2014; Publisher: Sebastian Kulik; PackageDescription: 0402; Manufacturer: Vishay
R4 = 10k_0402: Vishay CRCW series, 125mW, 1%; Manufacturer PartNr: CRCW040210K0FKEAHP; Deliverer PartNr: 1738864; TDE-PN: R0012; Deliverer: Farnell; Published: 12.02.2014; Publisher: Sebastian Kulik; PackageDescription: 0402; Manufacturer: Vishay; Part Description: Vishay CRCW series, 125mW, 1%
U1 = ADP3338AKCZ-3.3RL7: LDO, 3V3_1A; Deliverer PartNr: 1651283; Manufacturer: ADI; Deliverer: Farnell; TDE-PN: IC0003; Published: 26.03.2014; PackageDescription: SOT223-1; Publisher: Sebastian Kulik; Manufacturer PartNr: ADP3338AKCZ-3.3RL7
U4 = 24AA256: I2C  EEPROM; Deliverer PartNr: 1331295; Manufacturer: Microchip; Deliverer: Farnell; TDE-PN: IC0005; Published: 28.03.2014; PackageDescription: TSSOP8; Publisher: Sebastian Kulik; Manufacturer PartNr: 24AA256
U5 = PIC32MX220F032B-50I/ML: High Performance ROM-less Microcontroller; Deliverer PartNr: 2357345; Manufacturer: Microchip; Deliverer: Farnell; TDE-PN: IC0063; Published: 19.01.2015; PackageDescription: QFN28; Publisher: Sebastian Kulik; Manufacturer PartNr: PIC32MX220F032B-50I/ML

## Nets that join several sheets
3V3: DAU-3Phase-Measuring (18 pins), DAU-3Phase-PSU (21 pins)
GND: DAU-3Phase-Measuring (69 pins), DAU-3Phase-PSU (31 pins)
NetC1_1: DAU-3Phase-Measuring (TR1.L), DAU-3Phase-PSU (6 pins)
NetC24_1: DAU-3Phase-Measuring (C24.1 R15.2 U2.32 U3.32), DAU-3Phase-PSU (U5.28)
NetC25_1: DAU-3Phase-Measuring (C25.1 R14.2 U2.31 U3.31), DAU-3Phase-PSU (U5.9)
NetC26_1: DAU-3Phase-Measuring (C26.1 R13.2 U2.30 U3.30), DAU-3Phase-PSU (U5.22)
NetC27_1: DAU-3Phase-Measuring (C27.1 R12.2 U2.29), DAU-3Phase-PSU (U5.8)
NetC28_1: DAU-3Phase-Measuring (C28.1 R10.2 R16.2), DAU-3Phase-PSU (U5.11)
NetC44_1: DAU-3Phase-Measuring (C44.1 R33.2 R35.2), DAU-3Phase-PSU (U5.4)
NetC45_1: DAU-3Phase-Measuring (C45.1 R34.2 U3.29), DAU-3Phase-PSU (U5.3)
NetC50_2: DAU-3Phase-Measuring (TR1.N TR2.N TR3.N), DAU-3Phase-PSU (10 pins)
NetF2_2: DAU-3Phase-Measuring (TR2.L), DAU-3Phase-PSU (F2.2 F5.2)
NetF3_2: DAU-3Phase-Measuring (TR3.L), DAU-3Phase-PSU (F3.2 F6.2)